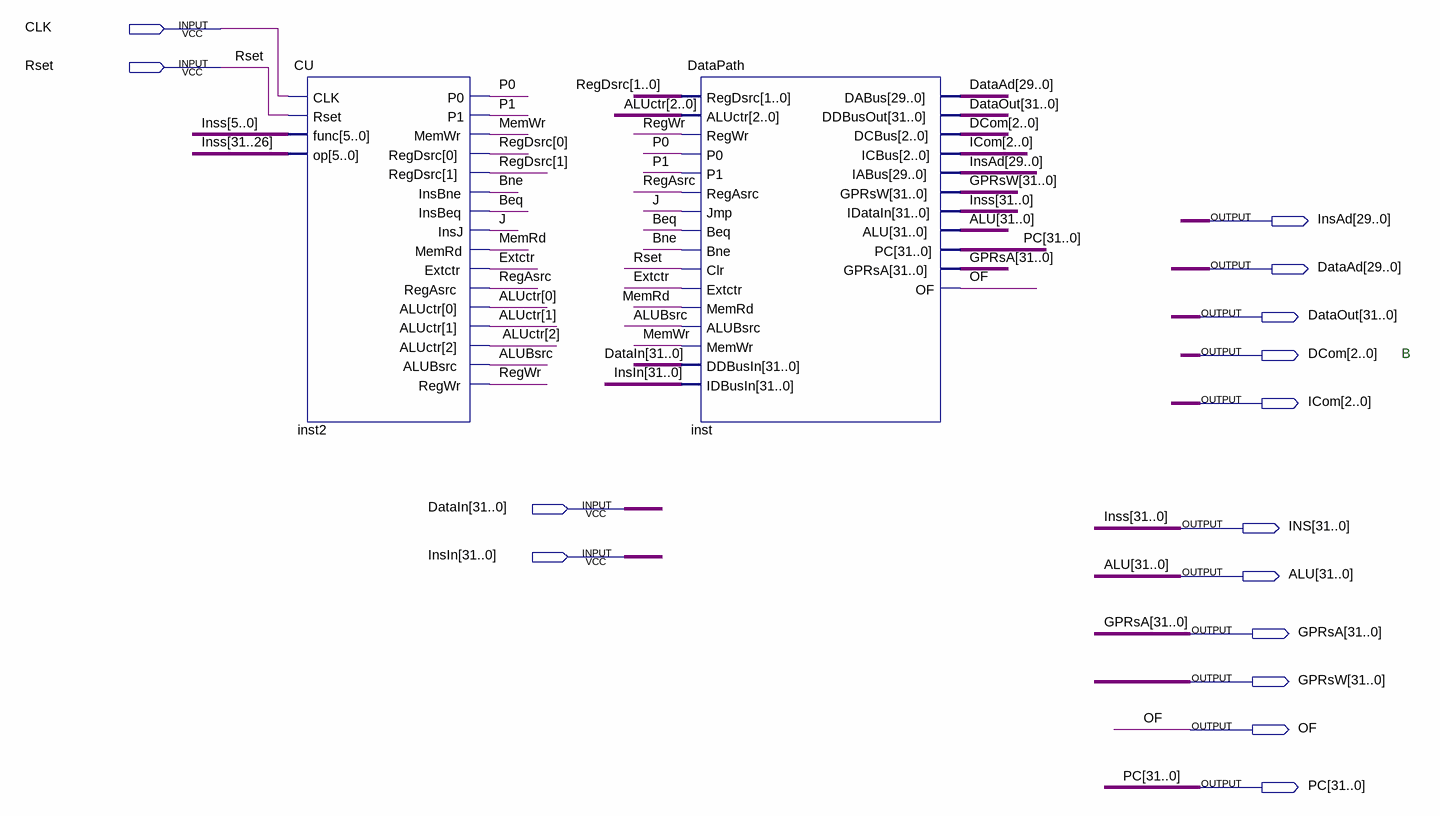
[diagram p0: schematic sheet]
// Quartus schematic CPU.bdf as structural Verilog: 2 symbols, 15 pins
module CPU (
  input  CLK,
  input  Rset,
  input  [31:0] DataIn,
  input  [31:0] InsIn,
  output [29:0] InsAd,
  output [29:0] DataAd,
  output [31:0] DataOut,
  output [2:0] DCom,
  output [2:0] ICom,
  output [31:0] INS,
  output [31:0] ALU,
  output [31:0] GPRsA,
  output [31:0] GPRsW,
  output OF,
  output [31:0] PC
);

  wire ALUBsrc, Beq, Bne, Extctr, J, MemRd, MemWr, P0, P1, RegAsrc, RegWr;
  wire [1:0] RegDsrc;
  wire [2:0] ALUctr;

  CU inst2 (
    .CLK(CLK), .Rset(Rset), .func(INS[5:0]), .op(INS[31:26]), .P0(P0), .P1(P1), .MemWr(MemWr),
    .RegDsrc(RegDsrc), .InsBne(Bne), .InsBeq(Beq), .InsJ(J), .MemRd(MemRd), .Extctr(Extctr),
    .RegAsrc(RegAsrc), .ALUctr(ALUctr), .ALUBsrc(ALUBsrc), .RegWr(RegWr));
  DataPath inst (
    .RegDsrc(RegDsrc), .ALUctr(ALUctr), .RegWr(RegWr), .P0(P0), .P1(P1), .RegAsrc(RegAsrc), .Jmp(J),
    .Beq(Beq), .Bne(Bne), .Clr(Rset), .Extctr(Extctr), .MemRd(MemRd), .ALUBsrc(ALUBsrc), .MemWr(MemWr),
    .DDBusIn(DataIn), .IDBusIn(InsIn), .DABus(DataAd), .DDBusOut(DataOut), .DCBus(DCom), .ICBus(ICom),
    .IABus(InsAd), .GPRsW(GPRsW), .IDataIn(INS), .ALU(ALU), .PC(PC), .GPRsA(GPRsA), .OF(OF));

  // Other names for the same wires on the sheet: Inss[31:0] = INS

  // Notes on the sheet:
  //   B
endmodule
